# EAGLE schematic greedy_large (EAGLE 8.5.0)
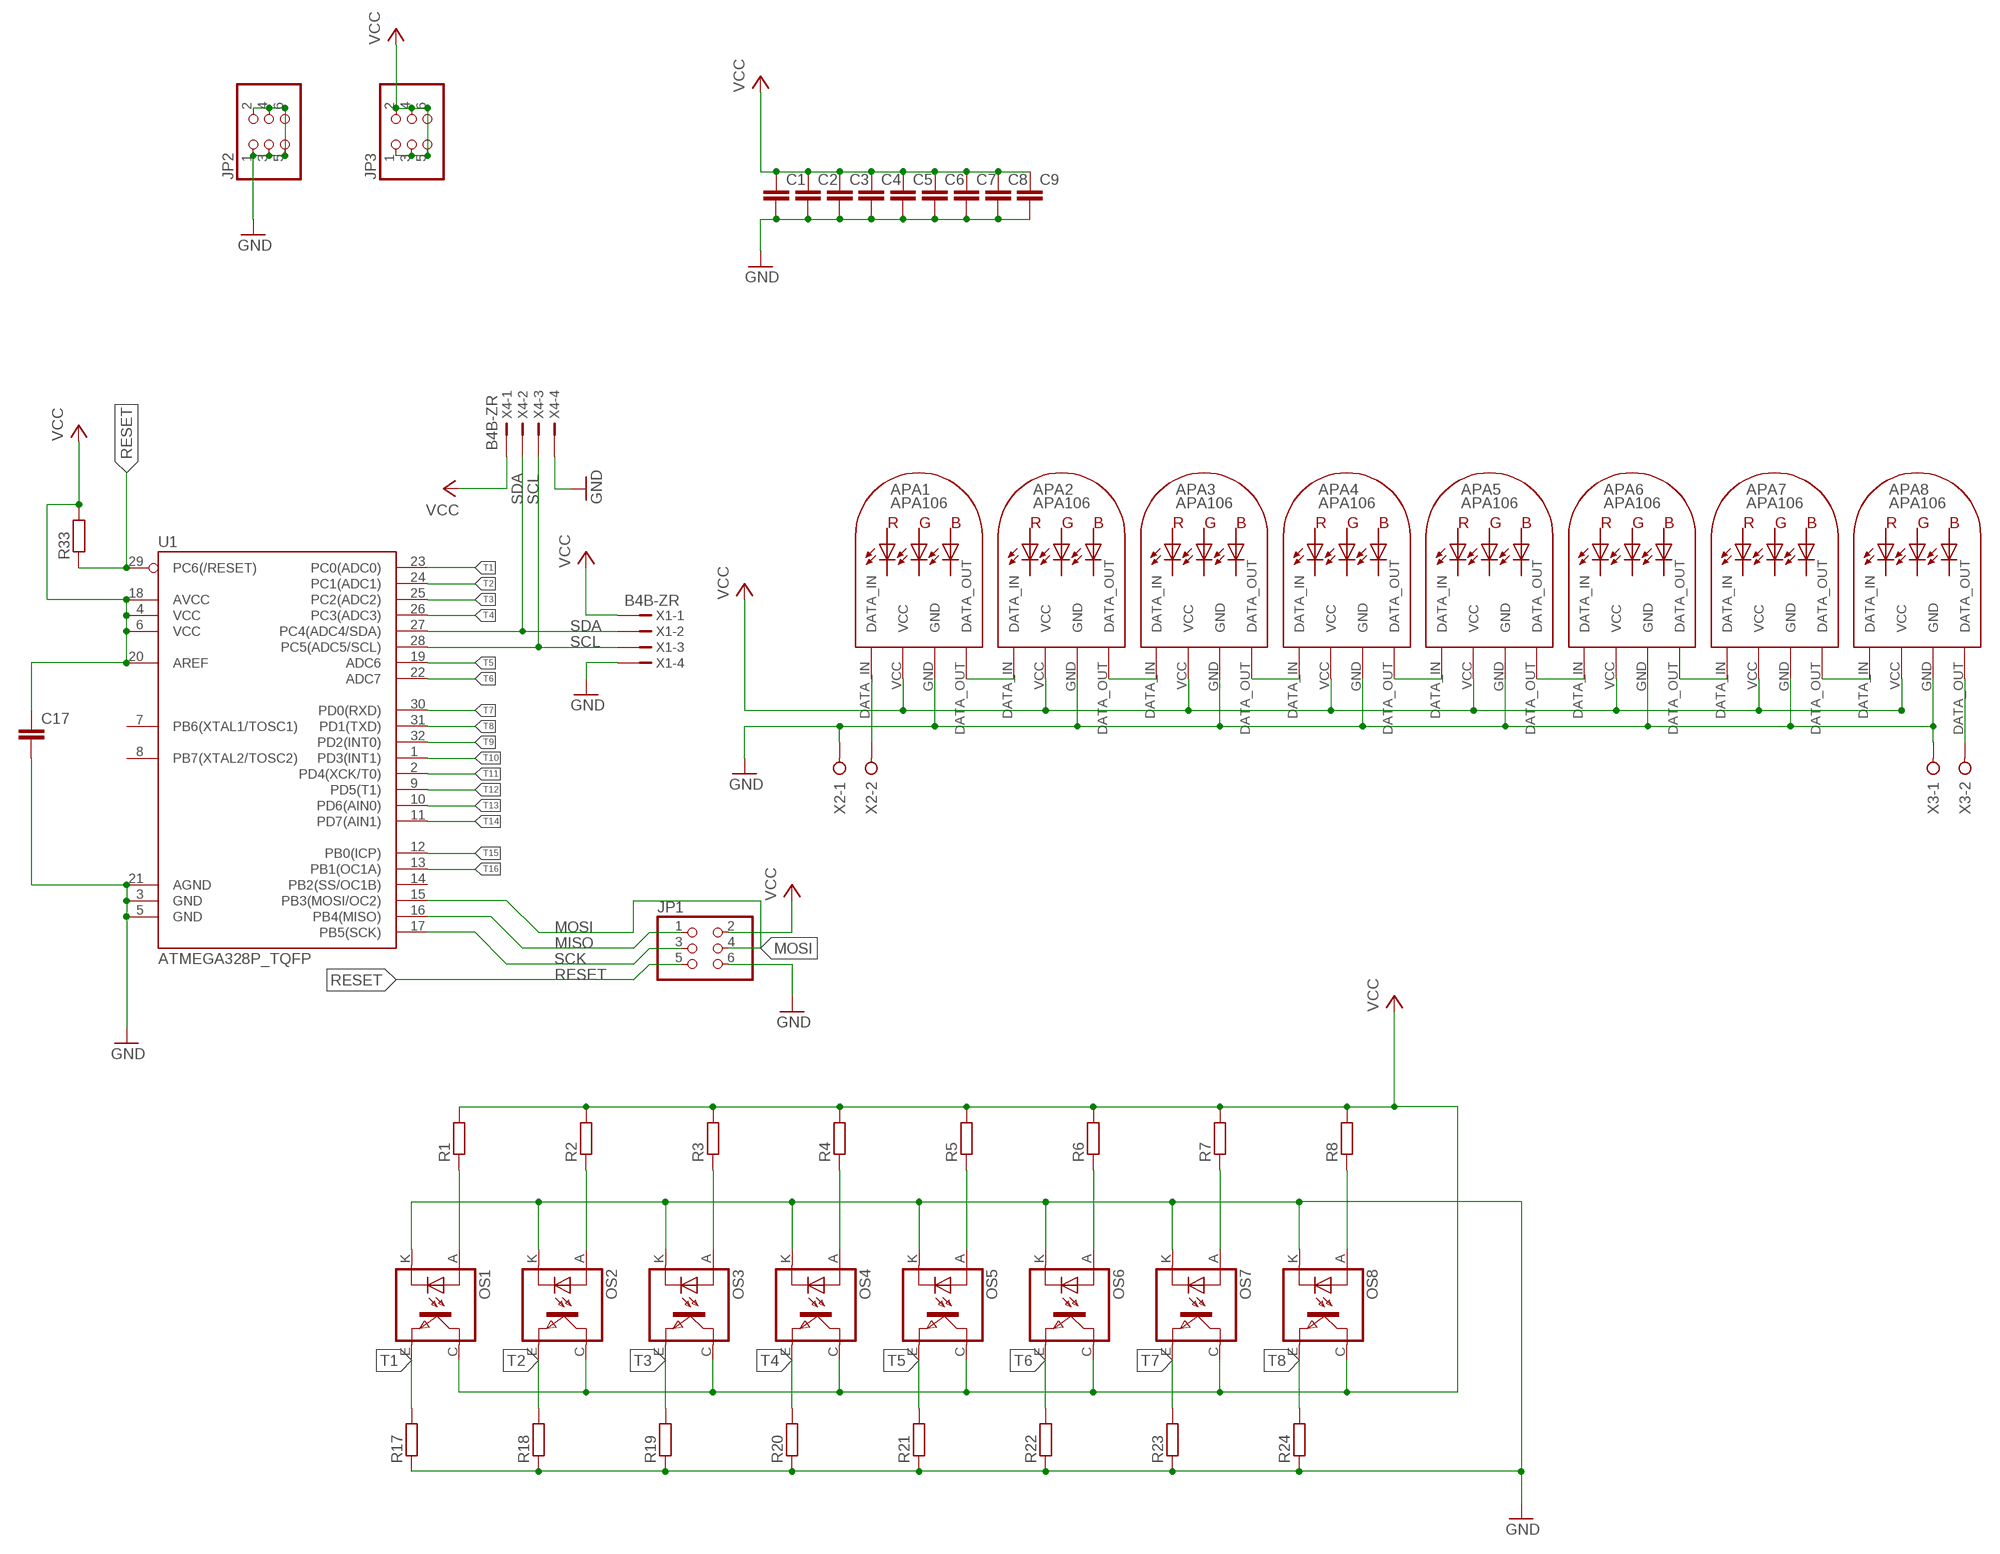
[diagram p0: schematic, sheet 1]

## Parts
APA1  APA106  [APA_106_8MM]
APA2  APA106  [APA_106_8MM]
APA3  APA106  [APA_106_8MM]
APA4  APA106  [APA_106_8MM]
APA5  APA106  [APA_106_8MM]
APA6  APA106  [APA_106_8MM]
APA7  APA106  [APA_106_8MM]
APA8  APA106  [APA_106_8MM]
C1  C5/3  [C5B3]
C2  C5/3  [C5B3]
C3  C5/3  [C5B3]
C4  C5/3  [C5B3]
C5  C5/3  [C5B3]
C6  C5/3  [C5B3]
C7  C5/3  [C5B3]
C8  C5/3  [C5B3]
C9  C5/3  [C5B3]
C17  C-EU025-025X050  [C025-025X050]
JP1  PINHD-2X3  [2X03]
JP2  PINHD-2X3  [2X03]
JP3  PINHD-2X3  [2X03]
OS1  TCRT5000  [TCRT5000]
OS2  TCRT5000  [TCRT5000]
OS3  TCRT5000  [TCRT5000]
OS4  TCRT5000  [TCRT5000]
OS5  TCRT5000  [TCRT5000]
OS6  TCRT5000  [TCRT5000]
OS7  TCRT5000  [TCRT5000]
OS8  TCRT5000  [TCRT5000]
R1  R-EU_R0805  [R0805]
R2  R-EU_R0805  [R0805]
R3  R-EU_R0805  [R0805]
R4  R-EU_R0805  [R0805]
R5  R-EU_R0805  [R0805]
R6  R-EU_R0805  [R0805]
R7  R-EU_R0805  [R0805]
R8  R-EU_R0805  [R0805]
R17  R-EU_R0805  [R0805]
R18  R-EU_R0805  [R0805]
R19  R-EU_R0805  [R0805]
R20  R-EU_R0805  [R0805]
R21  R-EU_R0805  [R0805]
R22  R-EU_R0805  [R0805]
R23  R-EU_R0805  [R0805]
R24  R-EU_R0805  [R0805]
R33  R-EU_R0805  [R0805]
U1  ATMEGA328P_TQFP  [TQFP32-08]
X1  B4B-ZR  [B4B-ZR]
X2  W237-02P  [W237-132]
X3  W237-02P  [W237-132]
X4  B4B-ZR  [B4B-ZR]

## Nets
GND: APA1.GND APA2.GND APA3.GND APA4.GND APA5.GND APA6.GND APA7.GND APA8.GND C1.2 C2.2 C3.2 C4.2 C5.2 C6.2 C7.2 C8.2 C9.2 C17.2 JP1.6 JP2.1 JP2.2 JP2.3 JP2.4 JP2.5 JP2.6 OS1.K(CATHODE) OS2.K(CATHODE) OS3.K(CATHODE) OS4.K(CATHODE) OS5.K(CATHODE) OS6.K(CATHODE) OS7.K(CATHODE) OS8.K(CATHODE) R17.1 R17.11 R18.1 R18.11 R19.1 R19.11 R20.1 R20.11 R21.1 R21.11 R22.1 R22.11 R23.1 R23.11 R24.1 R24.11 U1.3(GND) U1.5(GND) U1.21(AGND) X1.4 X2.1 X3.1 X4.4
MISO: JP1.1 U1.16(PB4(MISO))
MOSI: JP1.4 U1.15(PB3(MOSI/OC2))
N$1: APA1.DATA_IN X2.2
N$2: OS1.A(ANODE) R1.1 R1.11
N$3: OS2.A(ANODE) R2.1 R2.11
N$4: OS3.A(ANODE) R3.1 R3.11
N$5: OS4.A(ANODE) R4.1 R4.11
N$6: OS5.A(ANODE) R5.1 R5.11
N$7: OS6.A(ANODE) R6.1 R6.11
N$8: OS7.A(ANODE) R7.1 R7.11
N$9: OS8.A(ANODE) R8.1 R8.11
N$18: APA8.DATA_OUT X3.2
N$33: APA1.DATA_OUT APA2.DATA_IN
N$34: APA2.DATA_OUT APA3.DATA_IN
N$35: APA3.DATA_OUT APA4.DATA_IN
N$36: APA4.DATA_OUT APA5.DATA_IN
N$37: APA5.DATA_OUT APA6.DATA_IN
N$38: APA6.DATA_OUT APA7.DATA_IN
N$39: APA7.DATA_OUT APA8.DATA_IN
RESET: JP1.5 R33.1 R33.11 U1.29(PC6(/RESET))
SCK: JP1.3 U1.17(PB5(SCK))
SCL: U1.28(PC5(ADC5/SCL)) X1.3 X4.3
SDA: U1.27(PC4(ADC4/SDA)) X1.2 X4.2
T1: OS1.E(EMITTER) R17.2 R17.21 U1.23(PC0(ADC0))
T2: OS2.E(EMITTER) R18.2 R18.21 U1.24(PC1(ADC1))
T3: OS3.E(EMITTER) R19.2 R19.21 U1.25(PC2(ADC2))
T4: OS4.E(EMITTER) R20.2 R20.21 U1.26(PC3(ADC3))
T5: OS5.E(EMITTER) R21.2 R21.21 U1.19(ADC6)
T6: OS6.E(EMITTER) R22.2 R22.21 U1.22(ADC7)
T7: OS7.E(EMITTER) R23.2 R23.21 U1.30(PD0(RXD))
T8: OS8.E(EMITTER) R24.2 R24.21 U1.31(PD1(TXD))
T9: U1.32(PD2(INT0))
T10: U1.1(PD3(INT1))
T11: U1.2(PD4(XCK/T0))
T12: U1.9(PD5(T1))
T13: U1.10(PD6(AIN0))
T14: U1.11(PD7(AIN1))
T15: U1.12(PB0(ICP))
T16: U1.13(PB1(OC1A))
VCC: APA1.VCC APA2.VCC APA3.VCC APA4.VCC APA5.VCC APA6.VCC APA7.VCC APA8.VCC C1.1 C2.1 C3.1 C4.1 C5.1 C6.1 C7.1 C8.1 C9.1 C17.1 JP1.2 JP3.1 JP3.2 JP3.3 JP3.4 JP3.5 JP3.6 OS1.C(COLLECTOR) OS2.C(COLLECTOR) OS3.C(COLLECTOR) OS4.C(COLLECTOR) OS5.C(COLLECTOR) OS6.C(COLLECTOR) OS7.C(COLLECTOR) OS8.C(COLLECTOR) R1.2 R1.21 R2.2 R2.21 R3.2 R3.21 R4.2 R4.21 R5.2 R5.21 R6.2 R6.21 R7.2 R7.21 R8.2 R8.21 R33.2 R33.21 U1.4(VCC) U1.6(VCC) U1.18(AVCC) U1.20(AREF) X1.1 X4.1
Unconnected: U1.7(PB6(XTAL1/TOSC1)) U1.8(PB7(XTAL2/TOSC2)) U1.14(PB2(SS/OC1B))

## Library data of the parts
APA1-APA8 = apa106:APA106
C1-C9 = capacitor-wima:C: CAPACITOR naming: grid - package width
C17 = rcl:C-EU: CAPACITOR, European symbol; SPICEPREFIX: C
JP1-JP3 = pinhead:PINHD-2X3: PIN HEADER
OS1-OS8 = tcrt5000:TCRT5000
R1-R8 R17-R24 R33 = rcl:R-EU_: RESISTOR, European symbol; SPICEPREFIX: R
U1 = SparkFun-IC-Microcontroller:ATMEGA328P_TQFP: Popular 328P in QFP Storefront component: ATmega328 - TQFP <https://www.sparkfun.com/products/13448> (COM-13448) Datasheet <http://www.sparkfun.com/datasheets/Components/SMD/ATMega328.pdf> SparkFun Products SparkFun RedBoard - Programmed with Arduino <https://www.sparkfun.com/products/12757> (DEV-12757) Arduino Pro Mini 328 - 5V/16MHz <https://www.sparkfun.com/products/11113> (DEV-11113) Arduino Pro Mini 328 - 3.3V/8MHz <https://www.sparkfun.com/products/11114> (DEV-11114) SparkFun OpenLog <https://www.sparkfun.com/products/13712> (DEV-13712) SparkFun MicroView - OLED Arduino Module <https://www.sparkfun.com/products/12923> (DEV-12923) SparkFun Digital Sandbox <https://www.sparkfun.com/products/12651> (DEV-12651) SparkFun PicoBoard <https://www.sparkfun.com/products/11888> (WIG-11888) Arduino Fio <https://www.sparkfun.com/products/10116> (DEV-10116) LilyPad Arduino 328 Main Board <https://www.sparkfun.com/products/13342> (DEV-13342) SparkFun RedStick <https://www.sparkfun.com/products/13741> (DEV-13741) LilyPad MP3 <https://www.sparkfun.com/products/11013> (DEV-11013) LilyPad Arduino SimpleSnap <https://www.sparkfun.com/products/10941> (DEV-10941) SparkFun Stepoko <https://www.sparkfun.com/products/13899> (ROB-13899) SparkFun Geiger Counter <https://www.sparkfun.com/products/11345> (SEN-11345) SparkFun EL Sequencer <https://www.sparkfun.com/products/12781> (COM-12781) Arduino Pro 328 - 5V/16MHz <https://www.sparkfun.com/products/10915> (DEV-10915) CryptoCape <https://www.sparkfun.com/products/12773> (DEV-12773) SparkFun IR Thermometer Evaluation Board - MLX90614 <https://www.sparkfun.com/products/10740> (SEN-10740) SparkFun RedBot Mainboard <https://www.sparkfun.com/products/12097> (ROB-12097) Arduino Pro 328 - 3.3V/8MHz <https://www.sparkfun.com/products/10914> (DEV-10914) SparkFun Block for Intel® Edison - Arduino <https://www.sparkfun.com/products/13036> (DEV-13036) SparkFun Simon Says - Surface Mount Soldering Kit <https://www.sparkfun.com/products/10935> (KIT-10935) SparkFun 7-Segment Serial Display - Red <https://www.sparkfun.com/products/11441> (COM-11441) SparkFun 7-Segment Serial Display - White <https://www.sparkfun.com/products/11629> (COM-11629) SparkFun 7-Segment Serial Display - Yellow <https://www.sparkfun.com/products/11443> (COM-11443) SparkFun 7-Segment Serial Display - Kelly Green <https://www.sparkfun.com/products/11440> (COM-11440) SparkFun 7-Segment Serial Display - Blue <https://www.sparkfun.com/products/11442> (COM-11442) SparkFun OpenSegment Serial Display - 20mm (Blue) <https://www.sparkfun.com/products/11647> (COM-11647) SparkFun OpenSegment Serial Display - 20mm (Green) <https://www.sparkfun.com/products/11646> (COM-11646) SparkFun OpenSegment Serial Display - 20mm (White) <https://www.sparkfun.com/products/11648> (COM-11648) SparkFun OpenSegment Serial Display - 20mm (Red) <https://www.sparkfun.com/products/11644> (COM-11644) SparkFun OpenSegment Serial Display - 20mm (Yellow) <https://www.sparkfun.com/products/11645> (COM-11645) SparkFun OpenSegment Shield <https://www.sparkfun.com/products/13190> (DEV-13190); PROD_ID: IC-09069
X1 X4 = alldevads1262_teensy_ftdi_ref:?4B-ZR: ZH CONNECTOR 1.5 mm, 4 pin 1 row Source: http://www.jst.com .. eZH.pdf; MF: FARNELL; MPN: B4B-ZR(LF)(SN); OC_FARNELL: 1830916; OC_NEWARK: 37K9960
X2 X3 = con-wago-508:W237-02P: WAGO SREW CLAMP; OC_FARNELL: unknown; OC_NEWARK: unknown